# Altium schematic sheet 5.ETH.SchDoc
size A3; SheetNumber: 6; SheetTotal: 10
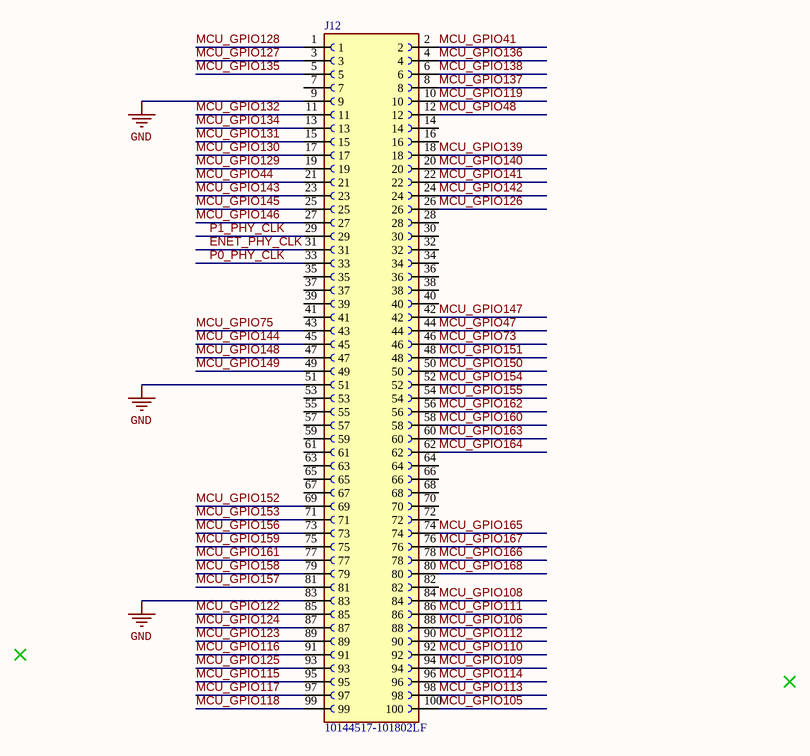
[diagram p0: 5.ETH.SchDoc]

## Parts
J12  10144517-101802LF  [AMPHENOL_10144517-101802LF]

## Nets
GND: J12.9 J12.51 J12.83
ENET_PHY_CLK: J12.31
MCU_GPIO41: J12.2
MCU_GPIO44: J12.21
MCU_GPIO47: J12.44
MCU_GPIO48: J12.12
MCU_GPIO73: J12.46
MCU_GPIO75: J12.43
MCU_GPIO105: J12.100
MCU_GPIO106: J12.88
MCU_GPIO108: J12.84
MCU_GPIO109: J12.94
MCU_GPIO110: J12.92
MCU_GPIO111: J12.86
MCU_GPIO112: J12.90
MCU_GPIO113: J12.98
MCU_GPIO114: J12.96
MCU_GPIO115: J12.95
MCU_GPIO116: J12.91
MCU_GPIO117: J12.97
MCU_GPIO118: J12.99
MCU_GPIO119: J12.10
MCU_GPIO122: J12.85
MCU_GPIO123: J12.89
MCU_GPIO124: J12.87
MCU_GPIO125: J12.93
MCU_GPIO126: J12.26
MCU_GPIO127: J12.3
MCU_GPIO128: J12.1
MCU_GPIO129: J12.19
MCU_GPIO130: J12.17
MCU_GPIO131: J12.15
MCU_GPIO132: J12.11
MCU_GPIO134: J12.13
MCU_GPIO135: J12.5
MCU_GPIO136: J12.4
MCU_GPIO137: J12.8
MCU_GPIO138: J12.6
MCU_GPIO139: J12.18
MCU_GPIO140: J12.20
MCU_GPIO141: J12.22
MCU_GPIO142: J12.24
MCU_GPIO143: J12.23
MCU_GPIO144: J12.45
MCU_GPIO145: J12.25
MCU_GPIO146: J12.27
MCU_GPIO147: J12.42
MCU_GPIO148: J12.47
MCU_GPIO149: J12.49
MCU_GPIO150: J12.50
MCU_GPIO151: J12.48
MCU_GPIO152: J12.69
MCU_GPIO153: J12.71
MCU_GPIO154: J12.52
MCU_GPIO155: J12.54
MCU_GPIO156: J12.73
MCU_GPIO157: J12.81
MCU_GPIO158: J12.79
MCU_GPIO159: J12.75
MCU_GPIO160: J12.58
MCU_GPIO161: J12.77
MCU_GPIO162: J12.56
MCU_GPIO163: J12.60
MCU_GPIO164: J12.62
MCU_GPIO165: J12.74
MCU_GPIO166: J12.78
MCU_GPIO167: J12.76
MCU_GPIO168: J12.80
P0_PHY_CLK: J12.33
P1_PHY_CLK: J12.29

Not connected (* = marked no-connect by the designer): J12 7 14 16 28 30 32 34 35 36 37 38 39 40 41 53 55 57 59 61 63 64 65 66 67 68 70 72 82

## Library data of the parts
J12 = CMP-002-00178-1: Socket(male) 100 Positions, Dual Row, Vertical Receptacle. BergStak Lite 0.80mm, Board-to-Board Connector,; MF: AMPHENOL ICC / FCI; Source: SamacSys.SchLib; Check_prices: https://www.snapeda.com/parts/10144517-101802LF/Amphenol/view-part/?ref=eda; Value: *; Case/Package: None; MP: 10144517-101802LF; Design Item ID: 10144517-101802LF; SnapEDA_Link: https://www.snapeda.com/parts/10144517-101802LF/Amphenol/view-part/?ref=snap